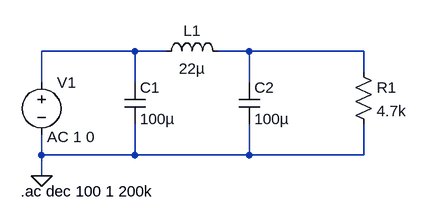
[diagram p0: schematic pi-filter-for-power-supply.asc]
pi-filter-for-power-supply.asc, the LTspice schematic file:
Version 4
SHEET 1 880 680
WIRE 160 64 16 64
WIRE 208 64 160 64
WIRE 336 64 288 64
WIRE 512 64 336 64
WIRE 512 96 512 64
WIRE 16 112 16 64
WIRE 160 112 160 64
WIRE 336 112 336 64
WIRE 16 224 16 192
WIRE 160 224 160 176
WIRE 160 224 16 224
WIRE 336 224 336 176
WIRE 336 224 160 224
WIRE 512 224 512 176
WIRE 512 224 336 224
WIRE 16 256 16 224
FLAG 16 256 0
SYMBOL voltage 16 96 R0
WINDOW 123 9 100 Left 2
WINDOW 39 0 0 Left 0
SYMATTR Value2 AC 1 0
SYMATTR InstName V1
SYMATTR Value ""
SYMBOL ind 192 80 R270
WINDOW 0 32 56 VTop 2
WINDOW 3 5 56 VBottom 2
SYMATTR InstName L1
SYMATTR Value 22µ
SYMATTR SpiceLine Rser=1.25
SYMBOL cap 144 112 R0
SYMATTR InstName C1
SYMATTR Value 100µ
SYMBOL cap 320 112 R0
SYMATTR InstName C2
SYMATTR Value 100µ
SYMBOL res 496 80 R0
SYMATTR InstName R1
SYMATTR Value 4.7k
TEXT -16 280 Left 2 !.ac dec 100 1 200k

The netlist it stands for:
* pi-filter-for-power-supply.asc
V1 N001 0 AC 1 0
L1 N001 N002 22µ Rser=1.25
C1 N001 0 100µ
C2 N002 0 100µ
R1 N002 0 4.7k
.ac dec 100 1 200k
.backanno
.end